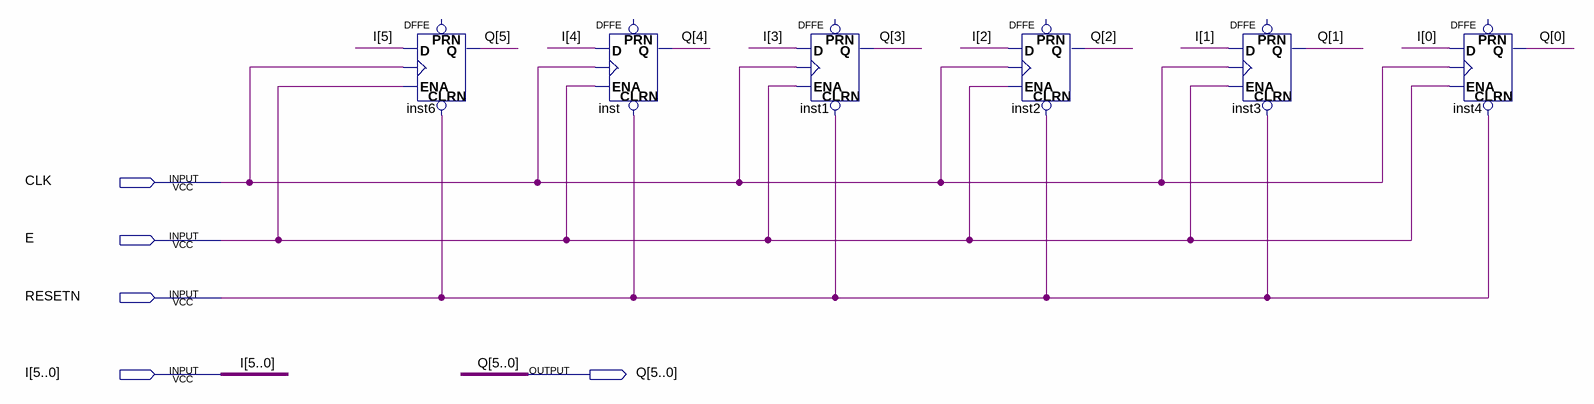
[diagram p0: schematic sheet]
// Quartus schematic REGISTER.bdf as structural Verilog: 6 symbols, 5 pins
module REGISTER (
  input  CLK,
  input  E,
  input  RESETN,
  input  [5:0] I,
  output [5:0] Q
);

  DFFE inst6 (.CLRN(RESETN), .D(I[5]), .CLK(CLK), .ENA(E), .Q(Q[5]));  // open: PRN
  DFFE inst (.CLRN(RESETN), .D(I[4]), .CLK(CLK), .ENA(E), .Q(Q[4]));  // open: PRN
  DFFE inst1 (.CLRN(RESETN), .D(I[3]), .CLK(CLK), .ENA(E), .Q(Q[3]));  // open: PRN
  DFFE inst2 (.CLRN(RESETN), .D(I[2]), .CLK(CLK), .ENA(E), .Q(Q[2]));  // open: PRN
  DFFE inst3 (.CLRN(RESETN), .D(I[1]), .CLK(CLK), .ENA(E), .Q(Q[1]));  // open: PRN
  DFFE inst4 (.CLRN(RESETN), .D(I[0]), .CLK(CLK), .ENA(E), .Q(Q[0]));  // open: PRN
endmodule
